# Altium schematic sheet Sheet1.SchDoc
size A; SheetNumber: 1; SheetTotal: 1
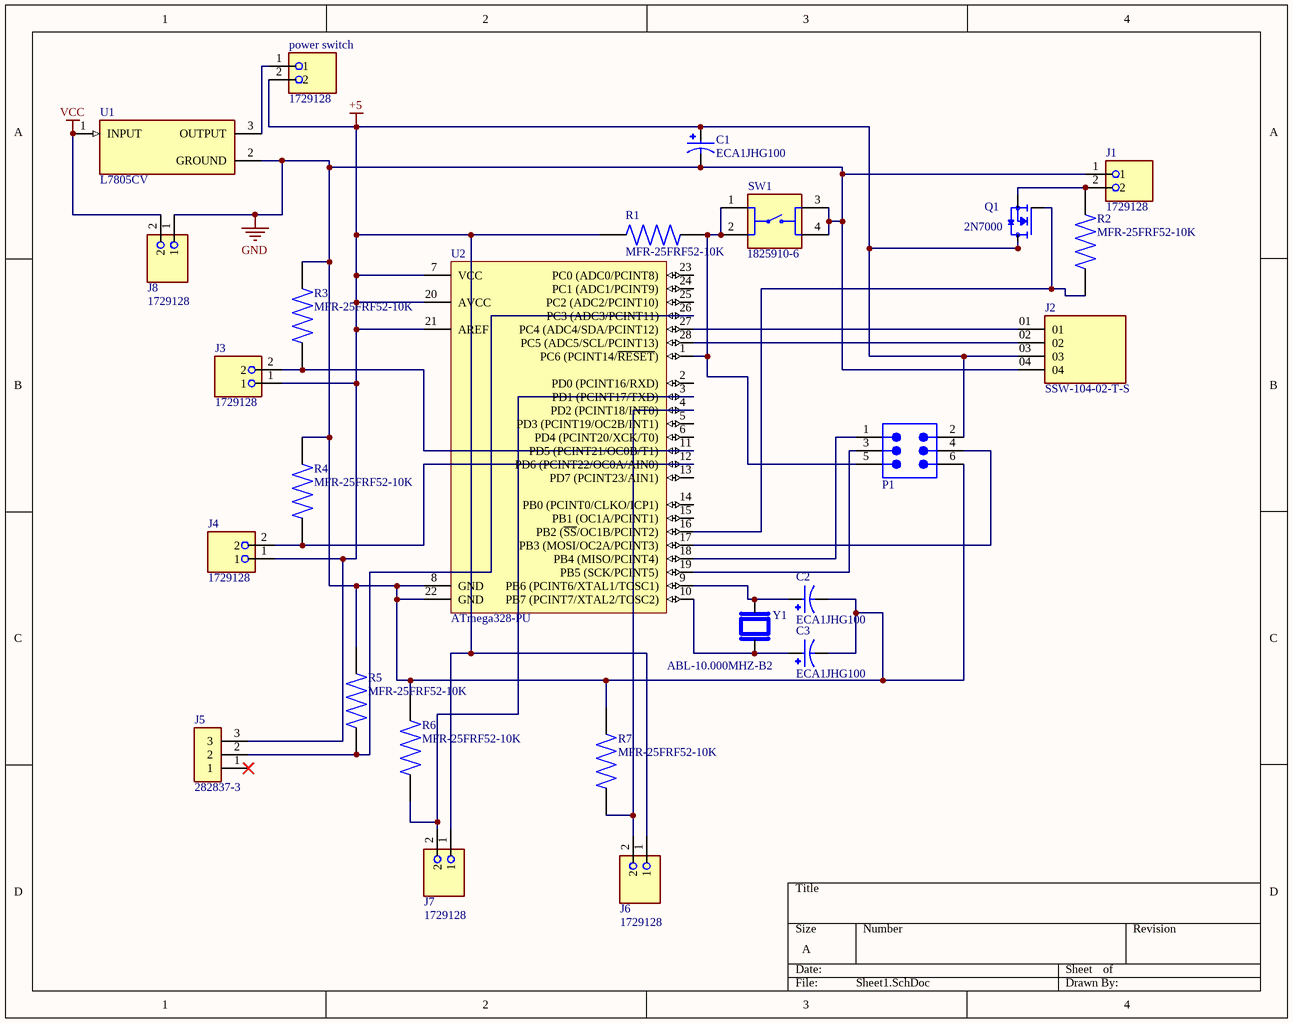
[diagram p0: Sheet1.SchDoc]

## Parts
C1  ECA1JHG100  [CAPPRD200W50D500H1100]
C2  ECA1JHG100  [CAPPRD200W50D500H1100]
C3  ECA1JHG100  [CAPPRD200W50D500H1100]
J1  1729128  [PHOENIX_1729128]
J2  SSW-104-02-T-S  [SAMTEC_SSW-104-02-T-S]
J3  1729128  [PHOENIX_1729128]
J4  1729128  [PHOENIX_1729128]
J5  282837-3  [TE_282837-3]
J6  1729128  [PHOENIX_1729128]
J7  1729128  [PHOENIX_1729128]
J8  1729128  [PHOENIX_1729128]
P1  61200621621  [61200621621]  (value not drawn)
power_switch  1729128  [PHOENIX_1729128]
Q1  2N7000  [TO92254P458H750-3]
R1  MFR-25FRF52-10K  [RESAD1100W55L680D260]
R2  MFR-25FRF52-10K  [RESAD1100W55L680D260]
R3  MFR-25FRF52-10K  [RESAD1100W55L680D260]
R4  MFR-25FRF52-10K  [RESAD1100W55L680D260]
R5  MFR-25FRF52-10K  [RESAD1100W55L680D260]
R6  MFR-25FRF52-10K  [RESAD1100W55L680D260]
R7  MFR-25FRF52-10K  [RESAD1100W55L680D260]
SW1  1825910-6  [SW_1825910-6-4]
U1  L7805CV  [TO255P1040X460X1968-3]
U2  ATmega328-PU  [28P3]
Y1  ABL-10.000MHZ-B2  [XTAL_HC49P488W46L1150T500H350]

## Nets
+5: C1.P J2.03 J3.1 J4.1 J5.3 J6.1 J7.1 P1.2 power_switch.2 Q1.3(D) R1.2 U2.7(VCC) U2.20(AVCC) U2.21(AREF)
GND: C1.N C2.N C3.N J1.1 J2.04 J8.1 P1.6 R3.2 R4.2 R5.2 R6.2 R7.2 SW1.3 SW1.4 U1.2(GROUND) U2.8(GND) U2.22(GND)
VCC: J8.2 U1.1(INPUT)
NetC2_P: C2.P U2.9(PB6_(PCINT6/XTAL1/TOSC1)) Y1.2
NetC3_P: C3.P U2.10(PB7_(PCINT7/XTAL2/TOSC2)) Y1.1
NetJ1_2: J1.2 Q1.1(S) R2.2
NetJ2_01: J2.01 U2.27(PC4_(ADC4/SDA/PCINT12))
NetJ2_02: J2.02 U2.28(PC5_(ADC5/SCL/PCINT13))
NetJ3_2: J3.2 R3.1 U2.11(PD5_(PCINT21/OC0B/T1))
NetJ4_2: J4.2 R4.1 U2.12(PD6_(PCINT22/OC0A/AIN0))
NetJ5_2: J5.2 R5.1 U2.26(PC3_(ADC3/PCINT11))
NetJ6_2: J6.2 R7.1 U2.4(PD2_(PCINT18/INT0))
NetJ7_2: J7.2 R6.1 U2.3(PD1_(PCINT17/TXD))
NetP1_1: P1.1 U2.18(PB4_(MISO/PCINT4))
NetP1_3: P1.3 U2.19(PB5_(SCK/PCINT5))
NetP1_4: P1.4 U2.17(PB3_(MOSI/OC2A/PCINT3))
NetP1_5: P1.5 R1.1 SW1.1 SW1.2 U2.1(PC6_(PCINT14/~{RESET}))
Netpower_switch_1: power_switch.1 U1.3(OUTPUT)
NetQ1_2: Q1.2(G) R2.1 U2.16(PB2_(~{SS}/OC1B/PCINT2))

Not connected (* = marked no-connect by the designer): J5 1*; U2 2(PD0_(PCINT16/RXD)) 5(PD3_(PCINT19/OC2B/INT1)) 6(PD4_(PCINT20/XCK/T0)) 13(PD7_(PCINT23/AIN1)) 14(PB0_(PCINT0/CLKO/ICP1)) 15(PB1_(OC1A/PCINT1)) 23(PC0_(ADC0/PCINT8)) 24(PC1_(ADC1/PCINT9)) 25(PC2_(ADC2/PCINT10))

## Library data of the parts
C1-C3 = ECA1JHG100: NHG-A; MF: Panasonic; SnapEDA_Link: https://www.snapeda.com/parts/ECA1JHG100/Panasonic/view-part/5791065/?ref=snap; Package: RADIAL-2 Panasonic; MP: ECA1JHG100; Price: None; Availability: No availability data; Check_prices: https://www.snapeda.com/parts/ECA1JHG100/Panasonic/view-part/5791065/?ref=eda; Value: *
J1 J3 J4 J6-J8 power_switch = 1729128: PCB Terminal Screw 5.08mm 16AWG 400V 13.5A 2 Position COMBICON MKDSN Series | Phoenix Contact 1729128; SnapEDA_Link: https://www.snapeda.com/parts/1729128/Phoenix+Contact/view-part/?ref=snap; Package: None; Value: *; MF: Phoenix Contact; MP: 1729128; Check_prices: https://www.snapeda.com/parts/1729128/Phoenix+Contact/view-part/?ref=eda
J2 = SSW-104-02-T-S: MF: Samtec Inc.; Value: *; Package: None; Price: None; MP: SSW-104-02-T-S; Availability: Unavailable
J5 = 282837-3: TERMI-BLOK PCB MOUNT 3P; Availability: Unavailable; Package: None; MP: 282837-3; Value: *; Price: None
P1 = 61200621621: WR-BHD Male Box Header, THT Straight, pitch 2.54mm, 2 row, 6 pin; Manufacturer: Wurth Elektronik; Contact Resistance: 20mOhm; Insulation Resistance: 1000MOhm; Rated Current: 3A; Working Voltage: 250V; Withstanding Voltage: 500V; Manufacturer Part Number: 61200621621; Category: Wire-to-Board Connectors; Match Code: WR-BHD; ComponentLink1Description: Website Link; ComponentLink1URL: https://www.we-online.com/redexpert/article/61200621621?ad; ComponentLink2Description: Datasheet Link; ComponentLink2URL: https://www.we-online.com/redexpert/spec/61200621621?ad; Mount: Through Hole; Operating Temperature Max: 105°C; Operating Temperature Min: -40°C; Packaging: Tray; Length: 15.28mm; Width: 9.1mm; Height: 9.1mm; Gender: Male; Number of Pins: 6; Number of Rows: 2; Orientation: Straight; Pitch: 2.54mm
Q1 = 2N7000: N-Channel 60 V 200mA (Ta) Through Hole TO-92; MF: NTE Electronics, Inc.; SnapEDA_Link: https://www.snapeda.com/parts/2N7000/NTE+Electronics/view-part/?ref=snap; Package: TO-226-3 NTE Electronics, Inc.; Value: *; MP: 2N7000; Check_prices: https://www.snapeda.com/parts/2N7000/NTE+Electronics/view-part/?ref=eda
R1-R7 = MFR-25FRF52-10K: 10.5 kOhms Â±1% 0.25W, 1/4W Through Hole Resistor Axial - Metal Film; MF: Yageo; SnapEDA_Link: https://www.snapeda.com/parts/MFR-25FRF52-10K/Yageo/view-part/?ref=snap; Package: RADIAL-2 YAGEO; Value: *; MP: MFR-25FRF52-10K; Check_prices: https://www.snapeda.com/parts/MFR-25FRF52-10K/Yageo/view-part/?ref=eda
SW1 = 1825910-6: Switch Push Button OFF (ON) SPST Round Button 0.05A 24VDC Momentary Contact PC Pins Thru-Hole; MF: TE Connectivity; Value: *; MP: 1825910-6; Package: None; Check_prices: https://www.snapeda.com/parts/1825910-6/TE+Connectivity+ALCOSWITCH+Switches/view-part/?ref=eda; SnapEDA_Link: https://www.snapeda.com/parts/1825910-6/TE+Connectivity+ALCOSWITCH+Switches/view-part/?ref=snap; Digi-Key_Part_Number: 450-1650-ND; Purchase-URL: https://pricing.snapeda.com/search/part/1825910-6/?ref=eda
U1 = L7805CV: Linear Voltage Regulator IC Positive Fixed 1 Output 1.5A TO-220; MF: STMicroelectronics; SnapEDA_Link: https://www.snapeda.com/parts/L7805CV/STMicroelectronics/view-part/?ref=snap; Package: TO-220-3 STMicroelectronics; Value: *; MP: L7805CV; Check_prices: https://www.snapeda.com/parts/L7805CV/STMicroelectronics/view-part/?ref=eda
U2 = CMP-0095-00015-2: 8-bit AVR Microcontroller, 32KB Flash, 1KB EEPROM, 2KB SRAM, 28-pin PDIP, Industrial Grade (-40°C to 85°C); ComponentLink3Description: ATmega48A/48PA/88A/88PA/168A/168PA/328/328P Summary; RevisionNote: DatasheetVersion updated. URLs added.; DatasheetVersion: revD, May-2011; ComponentLink1URL: http://www.atmel.com/; PackageVersion: revB, Sep-2001; PackageDescription: 28-lead (0.300"/7.62mm Wide) Plastic Dual Inline Package (PDIP); PackageReference: 28P3; ComponentLink1Description: Manufacturer URL; ComponentLink2Description: ATmega48A/48PA/88A/88PA/168A/168PA/328/328P Datasheet; ComponentLink3URL: http://www.atmel.com/dyn/resources/prod_documents/8271S.pdf; ComponentLink2URL: http://www.atmel.com/dyn/resources/prod_documents/8271.pdf
Y1 = ABL-10.000MHZ-B2: HC/49US (AT49) MICROPROCESSOR CRYSTAL; MF: Abracon LLC; Purchase-URL: https://pricing.snapeda.com/search/part/ABL-10.000MHZ-B2/?ref=eda; Value: *; Package: None; Check_prices: https://www.snapeda.com/parts/ABL-10.000MHZ-B2/Abracon+LLC/view-part/?ref=eda; Price: None; Availability: In Stock; MP: ABL-10.000MHZ-B2; SnapEDA_Link: https://www.snapeda.com/parts/ABL-10.000MHZ-B2/Abracon+LLC/view-part/?ref=snap